# Altium schematic sheet Audio.SchDoc
size A4; Revision: B.2(PCB.SCH)
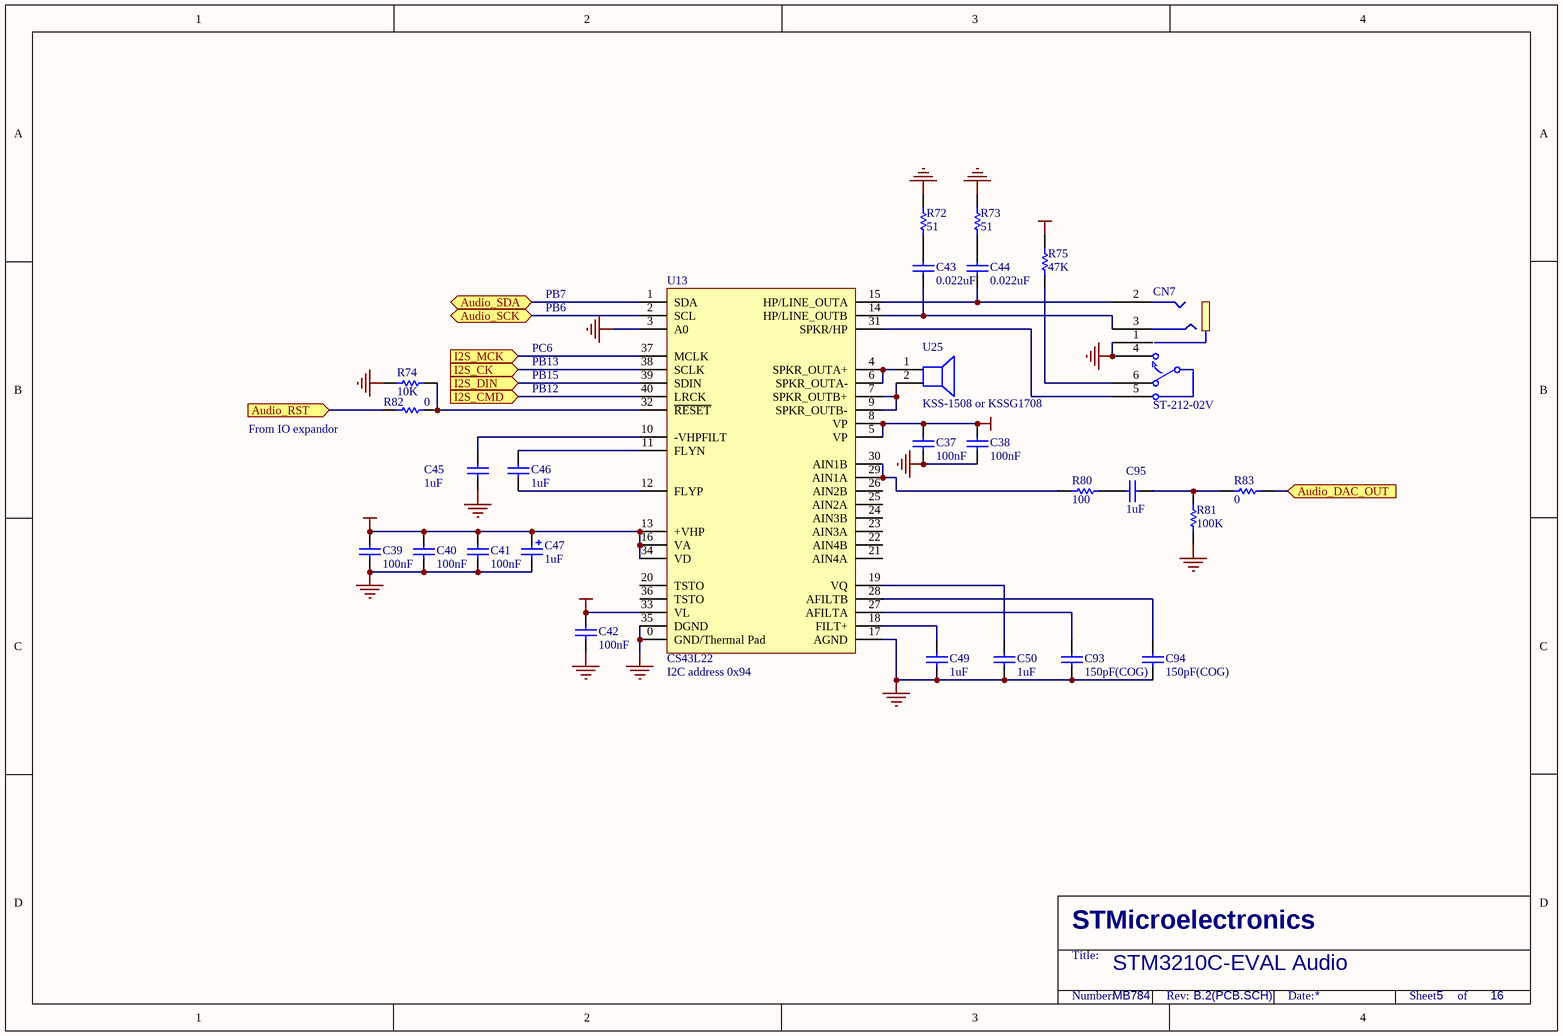
[diagram p0: Audio.SchDoc]

## Parts
C37  100nF  [0603C]
C38  100nF  [0603C]
C39  100nF  [0603C]
C40  100nF  [0603C]
C41  100nF  [0603C]
C42  100nF  [0603C]
C43  0.022uF  [0603C]
C44  0.022uF  [0603C]
C45  1uF  [0603C]
C46  1uF  [0603C]
C47  1uF  [TAN-A]
C49  1uF  [0603C]
C50  1uF  [0603C]
C93  150pF(COG)  [0603C]
C94  150pF(COG)  [0603C]
C95  1uF  [0603C]
CN7  ST-212-02V  [ST-212-02V]
R72  51  [0603R]
R73  51  [0603R]
R74  10K  [0603R]
R75  47K  [0603R]
R80  100  [0603R]
R81  100K  [0603R]
R82  0  [0603R]
R83  0  [0603R]
U13  CS43L22  [QFN40(6*6)]
U25  KSS-1508 or KSSG1708  [KS1708]

## Ports
Audio_DAC_OUT (in), Audio_RST (in), Audio_SCK (bidir), Audio_SDA (bidir), I2S_CK (in), I2S_CMD (in), I2S_DIN (in), I2S_MCK (in)

## Nets
+2V5: C39.2 C40.2 C41.2 C47.1 R75.1 U13.13(+VHP) U13.16(VA) U13.34(VD)
+3V3: C42.2 U13.33(VL)
+5V: C37.1 C38.1 U13.5(VP) U13.8(VP)
GND: C37.2 C38.2 C39.1 C40.1 C41.1 C42.1 C45.2 C47.2 C49.1 C50.1 C93.1 C94.1 CN7.1 CN7.4 R72.1 R73.1 R74.2 R81.2 U13.0(GND/Thermal_Pad) U13.3(A0) U13.17(AGND) U13.35(DGND)
Audio_DAC_OUT: R83.2 ; port Audio_DAC_OUT
Audio_RST: R82.2 ; port Audio_RST
Audio_SCK: U13.2(SCL) ; port Audio_SCK
Audio_SDA: U13.1(SDA) ; port Audio_SDA
I2S_CK: U13.38(SCLK) ; port I2S_CK
I2S_CMD: U13.40(LRCK) ; port I2S_CMD
I2S_DIN: U13.39(SDIN) ; port I2S_DIN
I2S_MCK: U13.37(MCLK) ; port I2S_MCK
NetC43_1: C43.1 R72.2
NetC43_2: C43.2 CN7.3 U13.14(HP/LINE_OUTB)
NetC44_1: C44.1 R73.2
NetC44_2: C44.2 CN7.2 U13.15(HP/LINE_OUTA)
NetC45_1: C45.1 U13.10(-VHPFILT)
NetC46_1: C46.1 U13.12(FLYP)
NetC46_2: C46.2 U13.11(FLYN)
NetC49_2: C49.2 U13.18(FILT+)
NetC50_2: C50.2 U13.19(VQ)
NetC93_2: C93.2 U13.27(AFILTA)
NetC94_2: C94.2 U13.28(AFILTB)
NetC95_1: C95.1 R80.1
NetC95_2: C95.2 R81.1 R83.1
NetCN7_5: CN7.5 U13.31(SPKR/HP)
NetCN7_6: CN7.6 R75.2
NetR74_1: R74.1 R82.1 U13.32(~{RESET})
NetR80_2: R80.2 U13.29(AIN1A) U13.30(AIN1B)
NetU13_4: U13.4(SPKR_OUTA+) U13.6(SPKR_OUTA-) U25.1(+)
NetU13_7: U13.7(SPKR_OUTB+) U13.9(SPKR_OUTB-) U25.2(-)

Not connected (* = marked no-connect by the designer): U13 20(TSTO) 21(AIN4A) 22(AIN4B) 23(AIN3A) 24(AIN3B) 25(AIN2A) 26(AIN2B) 36(TSTO)

## Notes on the sheet
- PB6
- PB7
- PC6
- PB15
- PB13
- From IO expandor
- PB12
- (near U13) I2C address 0x94
- STM3210C-EVAL Audio
- MB784
- 5
- 16
- STMicroelectronics
- Title:
- Number:
- Rev:
- Date:
- Sheet       of

## Library data of the parts
C37-C42 = CAP: Capacitor; Published: 8-Jun-2000; Revision: July-2002: Re-released for DXP Platform.; Publisher: Altium Limited; Value: 100nF
C43-C46 C49 C50 C93-C95 = CAP: Capacitor; Value: 100nF; Published: 8-Jun-2000; Revision: July-2002: Re-released for DXP Platform.; Publisher: Altium Limited
C47 = Cap Pol1: Polarized Capacitor (Radial); Value: 47uF; Published: 8-Jun-2000; Revision: July-2002: Re-released for DXP Platform.; Publisher: Altium Limited
R72-R75 R80-R83 = res1: Resistor; Value: 1K; Published: 8-Jun-2000; Revision: July-2002: Re-released for DXP Platform.; Publisher: Altium Limited
U25 = Speaker: Loudspeaker; Published: 24-Mar-1999; Revision: July-2002: Re-released for DXP Platform.; Publisher: Altium Limited